# EAGLE board BikeBikeAja|V2 (EAGLE 9.6.2)
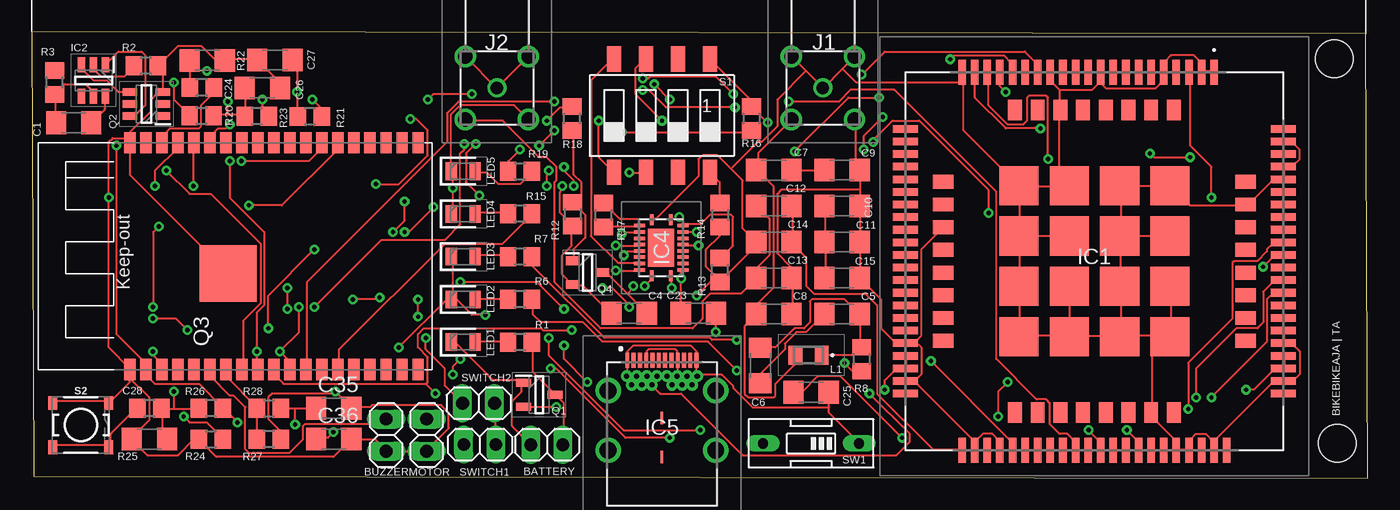
[diagram p4: board, top side]
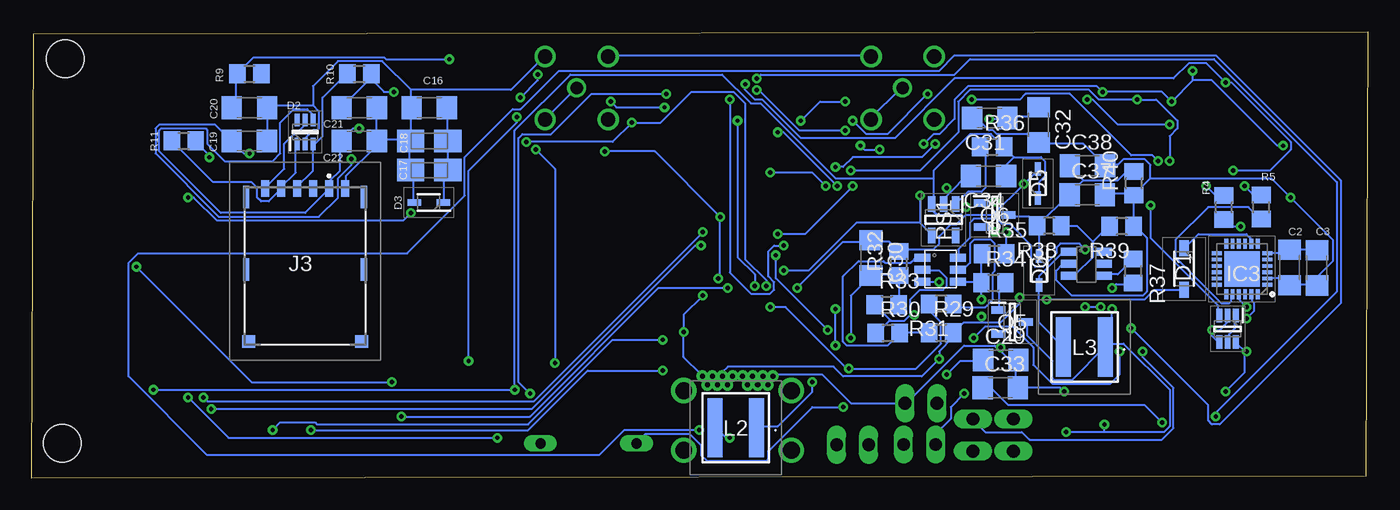
[diagram p5: board, bottom side, seen from below]

Size 106.04 x 35.45 mm. Coordinates in mm from the lower left corner, seen from the top.
Outline: 105.85,35.27 0,35.45 0.19,0.18 106.04,0 105.85,35.27
Copper layers (1*16): Top 0.035mm / dielectric 1.5mm / Bottom 0.035mm
Design rules "default": minimum track width 6mil, minimum drill 0.35mm, track to track 6mil, track to pad 6mil, pad to pad 6mil, via to via 6mil, smd to smd 6mil, copper to edge 40mil, drill to drill 6mil, minimum pad ring 10mil, minimum via ring 8mil, stop-mask expansion 4mil, vias tented up to drill 0mil, thermal gap 10mil
Holes 3 mm at 103.59,2.78 103.38,33.28

## Footprints (pad centres in the part's own frame; a part is rotated, then mirrored left to right if it is on the bottom)
1X02 = drill 1.016 long: 1 -1.27,0; 2 1.27,0
C1206 = smd 1.6 x 1.8: 1 -1.4,0; 2 1.4,0
A/3216-18W = smd 2.15 x 1.8: + 1.475,0; - -1.475,0
SOD3716X135N = smd 1.25 x 0.75: 1 -1.65,0; 2 1.65,0
SOT65P210X110-6N = smd 1 x 0.4: 1 -0.95,0.65; 2 -0.95,0; 3 -0.95,-0.65; 4 0.95,-0.65; 5 0.95,0; 6 0.95,0.65
SOD2513X114N = smd 1.075 x 0.5: 1 -1.15,0; 2 1.15,0
SIM7600GH = smd 0.6 x 2: 1 9.5,15; 2 8.5,15; 3 7.5,15; 4 6.5,15; 5 5.5,15; 6 4.5,15; 7 3.5,15; 8 2.5,15; 9 1.5,15; 10 0.5,15; 11 -0.5,15; 12 -1.5,15; 13 -2.5,15; 14 -3.5,15; 15 -4.5,15; 16 -5.5,15; 17 -6.5,15; 18 -7.5,15; 19 -8.5,15; 20 -9.5,15; 41 -9.5,-15; 42 -8.5,-15; 43 -7.5,-15; 44 -6.5,-15; 45 -5.5,-15; 46 -4.5,-15; 47 -3.5,-15; 48 -2.5,-15; 49 -1.5,-15; 50 -0.5,-15; 51 0.5,-15; 52 1.5,-15; 53 2.5,-15; 54 3.5,-15; 55 4.5,-15; 56 5.5,-15; 57 6.5,-15; 58 7.5,-15; 59 8.5,-15; 60 9.5,-15; 81 -10.5,15; 82 -10.5,-15; 85 10.5,-15 | smd 2 x 0.6: 21 -15,9.5; 22 -15,8.5; 23 -15,7.5; 24 -15,6.5; 25 -15,5.5; 26 -15,4.5; 27 -15,3.5; 28 -15,2.5; 29 -15,1.5; 30 -15,0.5; 31 -15,-0.5; 32 -15,-1.5; 33 -15,-2.5; 34 -15,-3.5; 35 -15,-4.5; 36 -15,-5.5; 37 -15,-6.5; 38 -15,-7.5; 39 -15,-8.5; 40 -15,-9.5; 61 15,-9.5; 62 15,-8.5; 63 15,-7.5; 64 15,-6.5; 65 15,-5.5; 66 15,-4.5; 67 15,-3.5; 68 15,-2.5; 69 15,-1.5; 70 15,-0.5; 71 15,0.5; 72 15,1.5; 73 15,2.5; 74 15,3.5; 75 15,4.5; 76 15,5.5; 77 15,6.5; 78 15,7.5; 79 15,8.5; 80 15,9.5; 83 -15,-10.5; 84 -15,10.5; 86 15,10.5; 87 15,-10.5 | smd 1.1 x 1.6: 88 6.3,12; 89 4.5,12; 90 2.7,12; 91 0.9,12; 92 -0.9,12; 93 -2.7,12; 94 -4.5,12; 95 -6.3,12; 104 -6.3,-12; 105 -4.5,-12; 106 -2.7,-12; 107 -0.9,-12; 108 0.9,-12; 109 2.7,-12; 110 4.5,-12; 111 6.3,-12 | smd 1.6 x 1.1: 96 -12,6.3; 97 -12,4.5; 98 -12,2.7; 99 -12,0.9; 100 -12,-0.9; 101 -12,-2.7; 102 -12,-4.5; 103 -12,-6.3; 112 12,-6.3; 113 12,-4.5; 114 12,-2.7; 115 12,-0.9; 116 12,0.9; 117 12,2.7; 118 12,4.5; 119 12,6.3 | smd 3.1 x 3.1: 120 6,6; 121 6,2; 122 6,-2; 123 6,-6; 124 2,6; 125 2,2; 126 2,-2; 127 2,-6; 128 -2,6; 129 -2,2; 130 -2,-2; 131 -2,-6; 132 -6,6; 133 -6,2; 134 -6,-2; 135 -6,-6
SOT95P280X145-6N = smd 1.2 x 0.6: 1 -1.25,0.95; 2 -1.25,0; 3 -1.25,-0.95; 4 1.25,-0.95; 5 1.25,0; 6 1.25,0.95
QFN50P400X400X80-25N = smd 0.8 x 0.3: 1 -2,1.25; 2 -2,0.75; 3 -2,0.25; 4 -2,-0.25; 5 -2,-0.75; 6 -2,-1.25; 13 2,-1.25; 14 2,-0.75; 15 2,-0.25; 16 2,0.25; 17 2,0.75; 18 2,1.25 | smd 0.3 x 0.8: 7 -1.25,-2; 8 -0.75,-2; 9 -0.25,-2; 10 0.25,-2; 11 0.75,-2; 12 1.25,-2; 19 1.25,2; 20 0.75,2; 21 0.25,2; 22 -0.25,2; 23 -0.75,2; 24 -1.25,2 | smd 2.8 x 2.8: 25 0,0
SN74LVC541ARGYR = smd 0.85 x 0.28: 1 -2.225,-0.75; 10 2.225,-0.75; 11 2.225,0.75; 20 -2.225,0.75 | smd 0.28 x 0.85: 2 -1.75,-1.725; 3 -1.25,-1.725; 4 -0.75,-1.725; 5 -0.25,-1.725; 6 0.25,-1.725; 7 0.75,-1.725; 8 1.25,-1.725; 9 1.75,-1.725; 12 1.75,1.725; 13 1.25,1.725; 14 0.75,1.725; 15 0.25,1.725; 16 -0.25,1.725; 17 -0.75,1.725; 18 -1.25,1.725; 19 -1.75,1.725 | smd 3.05 x 2.05: 21 0,0
632723100011 = smd 0.3 x 1.2: A1 -2.75,5.28; A2 -2.25,5.28; A3 -1.75,5.28; A4 -1.25,5.28; A5 -0.75,5.28; A6 -0.25,5.28; A7 0.25,5.28; A8 0.75,5.28; A9 1.25,5.28; A10 1.75,5.28; A11 2.25,5.28; A12 2.75,5.28 | drill 0.4 pad 0.7: B1 2.8,4.03; B2 2.4,3.33; B3 1.6,3.33; B4 1.2,4.03; B5 0.8,3.33; B6 0.4,4.03; B7 -0.4,4.03; B8 -0.8,3.33; B9 -1.2,4.03; B10 -1.6,3.33; B11 -2.4,3.33; B12 -2.8,4.03; G1 -2,4.03; G2 2,4.03 | drill 1.34 pad 2.01: MH1 -4.27,2.88; MH2 4.27,2.88; MH3 -4.27,-1.85; MH4 4.27,-1.85 | smd 0.2 x 1: MP1 0,0.7; MP2 0,-2.4
SMARACONNECTOR = drill 1.131 pad 1.697: 1 -6.376,2.5; 2 -1.376,2.5; 3 -6.376,-2.5; 4 -1.376,-2.5 | drill 1 pad 1.5: 5 -3.876,0
693043020611 = smd 0.65 x 1.3: C1 1.91,5.77; C2 -0.63,5.77; C3 -1.9,5.77; C5 3.18,5.77; C6 0.64,5.77; C7 -3.17,5.77 | smd 0.48 x 1.8: P1 -4.67,5.1; P2 -4.67,-0.65; P5 4.66,-0.65; P6 4.66,5.1 | smd 1.03 x 1: P3 -4.465,-6.37; P4 4.465,-6.37
B82498F = smd 1.1 x 1.5: 1 -1.05,0; 2 1.05,0
XFL5015152MEC = smd 1.18 x 4.7: 1 -1.655,0; 2 1.655,0
LEDC2012X85N = smd 0.9 x 1.4: 1 -0.95,0; 2 0.95,0
SOT95P280X145-5N = smd 1.2 x 0.6: 1 -1.25,0.95; 2 -1.25,0; 3 -1.25,-0.95; 4 1.25,-0.95; 5 1.25,0.95
SOT95P280X125-3N = smd 1.2 x 0.6: 1 -1.25,0.95; 2 -1.25,-0.95; 3 1.25,0
SOT95P285X140-6N = smd 1.15 x 0.6: 1 -1.3,0.95; 2 -1.3,0; 3 -1.3,-0.95; 4 1.3,-0.95; 5 1.3,0; 6 1.3,0.95
SOT65P230X110-6N = smd 1.05 x 0.45: 1 -1.05,0.65; 2 -1.05,0; 3 -1.05,-0.65; 4 1.05,-0.65; 5 1.05,0; 6 1.05,0.65
SOT95P240X120-3N = smd 1 x 0.7: 1 -1.2,0.95; 2 -1.2,-0.95; 3 1.2,0
SOT95P240X115-3N = smd 1.1 x 0.6: 1 -1.1,0.95; 2 -1.1,-0.95; 3 1.1,0
R0805 = smd 1.3 x 1.5: 1 -0.95,0; 2 0.95,0
SMS-004 = smd 1.092 x 2.007: 1 -3.81,-4.496; 2 -1.27,-4.496; 3 1.27,-4.496; 4 3.81,-4.496; 5 3.81,4.496; 6 1.27,4.496; 7 -1.27,4.496; 8 -3.81,4.496
TACTILE_SWITCH_SMD_4.5MM = smd 0.7 x 1.1: 1 2.225,1.75; 2 2.225,-1.75; 3 -2.225,-1.75; 4 -2.225,1.75
EDG-01 = drill 0.813 long: 1 0,-3.81; 2 0,3.81
JW5222 = smd 1.27 x 0.635: EN -1.27,0; FB 1.53,0; GND -1.27,-0.95; POK 1.53,-0.95; SW -1.27,-1.9; VIN 1.53,-1.9
ESP32-WROVER = smd 1.7 x 0.9: CLK 18,1.27; CMD 0,1.27; EN 0,21.59; GND 0,24.13; GND3 18,24.13; GND_2 0,6.35; IO0 18,7.62; IO2 18,6.35; IO4 18,8.89; IO5 18,12.7; IO12 0,7.62; IO13 0,5.08; IO14 0,8.89; IO15 18,5.08; IO18 18,13.97; IO19 18,15.24; IO21 18,17.78; IO22 18,21.59; IO23 18,22.86; IO25 0,12.7; IO26 0,11.43; IO27 0,10.16; IO32 0,15.24; IO33 0,13.97; IO34 0,17.78; IO35 0,16.51; NC0 18,16.51; NC1 18,10.16; NC2 18,11.43; RXD0 18,19.05; SD0 18,2.54; SD1 18,3.81; SD2 0,3.81; SD3 0,2.54; SENSOR_VN 0,19.05; SENSOR_VP 0,20.32; TXD0 18,20.32; VDD33 0,22.86 | smd 4.5 x 4.5: GND2 7.62,16.34
TCS9208 = smd 1.27 x 0.635: EN 4.07,-1.9; FB 1.27,-1.9; GND 1.27,-0.95; NC 4.07,0; SW 1.27,0; VIN 4.07,-0.95

## Placement (x,y rotation side)
BATTERY  [1X02]  40.89,2.68 0 top
BUZZER  [1X02]  28.13,3.44 270 top
C1  100nF  [C1206]  3.35,28.22 180 top
C2  10uF  [C1206]  6.23,16.73 270 bottom
C3  100nF  [C1206]  4.05,16.71 270 bottom
C4  0.1uF  [C1206]  47.42,13.1 0 top
C5  33pF  [C1206]  64.3,13.05 0 top
C6  100nF  [C1206]  57.83,8.96 90 top
C7  33pF  [C1206]  58.9,24.46 0 top
C8  NC  [C1206]  58.9,13.05 180 top
C9  NC  [C1206]  64.3,24.47 180 top
C10  10uF  [C1206]  64.3,21.61 0 top
C11  10uF  [C1206]  64.3,18.76 0 top
C12  0R  [C1206]  58.9,21.61 0 top
C13  NC  [C1206]  58.9,15.9 180 top
C14  NC  [C1206]  58.9,18.75 0 top
C15  1uF  [C1206]  64.3,15.9 0 top
C16  10uF  [C1206]  74.48,29.4 180 bottom
C17  100uF  [A/3216-18W]  74.48,24.46 0 bottom
C18  100uF  [A/3216-18W]  74.48,26.77 0 bottom
C19  22pF  [C1206]  88.76,26.77 0 bottom
C20  22pF  [C1206]  88.75,29.4 0 bottom
C21  22pF  [C1206]  80.03,29.4 0 bottom
C22  0.1uF  [C1206]  80.04,26.77 0 bottom
C23  100nF  [C1206]  52.91,13.1 180 top
C24  100nF  [C1206]  13.95,33.16 180 top
C25  33pF  [C1206]  61.85,6.84 180 top
C26  100nF  [C1206]  18.32,30.98 180 top
C27  10uF  [C1206]  19.31,33.19 0 top
C28  1uF  [C1206]  9.36,3.12 0 top
C29  22uF  [C1206]  29.13,9.4 0 bottom
C30  47pF  [C1206]  39.43,17.5 270 bottom
C31  22uF  [C1206]  30.01,28.59 180 bottom
C32  22uF  [C1206]  26.14,28.05 270 bottom
C33  100nF  [C1206]  29.17,7.2 0 bottom
C34  100nF  [C1206]  30.11,23.98 180 bottom
C35  1uF  [C1206]  23.98,5.57 0 top
C36  10uF  [C1206]  23.98,3.12 0 top
C37  22uF  [C1206]  22.27,22.5 0 bottom
C38  0.1uF  [C1206]  22.26,24.8 0 bottom
D1  1N4148_SOD-123_  [SOD3716X135N]  14.6,16.62 270 bottom
D2  SMF05C  [SOT65P210X110-6N]  84.33,27.48 90 bottom
D3  CDSOD323-T05L  [SOD2513X114N]  74.52,21.88 180 bottom
D5  CDSOD323-T05L  [SOD2513X114N]  26.19,23.39 90 bottom
D6  SS34  [SOD2513X114N]  26.1,16.5 270 bottom
IC1  SIM7600G-H  [SIM7600GH]  84.33,17.23 0 top
IC2  DW01B  [SOT95P280X145-6N]  4.93,31.57 270 top
IC3  CP2104-F03-GM  [QFN50P400X400X80-25N]  10,16.61 180 bottom
IC4  TXB0108RGYR  [SN74LVC541ARGYR]  49.96,18.3 90 top
IC5  632723100011  [632723100011]  50.02,4.09 0 top
J1  SMA-RA-CONNECTOR  [SMARACONNECTOR]  62.79,34.85 90 top
J2  SMA-RA-CONNECTOR  [SMARACONNECTOR]  36.93,34.85 90 top
J3  693043020611  [693043020611]  84.33,17.23 0 bottom
L1  B82498F3560G001  [B82498F]  61.65,9.78 180 top
L2  XFL5015-152MEC  [XFL5015152MEC]  50.17,4.03 180 bottom
L3  4.7uH  [XFL5015152MEC]  22.5,10.43 180 bottom
LED1  APT2012SURCK  [LEDC2012X85N]  34.25,10.82 0 top
LED2  APT2012SURCK  [LEDC2012X85N]  34.25,14.21 0 top
LED3  APT2012SURCK  [LEDC2012X85N]  34.25,17.59 0 top
LED4  APT2012SURCK  [LEDC2012X85N]  34.25,20.98 0 top
LED5  APT2012SURCK  [LEDC2012X85N]  34.25,24.37 0 top
MOTOR  [1X02]  31.35,3.44 270 top
PS1  MIC5231-3.3YM5-TR  [SOT95P280X145-5N]  33.68,20.52 270 bottom
Q1  AO3400  [SOT95P280X125-3N]  40.28,6.64 0 top
Q2  UMW8205A  [SOT95P285X140-6N]  9.12,29.7 180 top
Q3  UMH3N  [SOT65P230X110-6N]  11.14,11.87 270 bottom
Q4  MMBT3904  [SOT95P240X120-3N]  44.11,16.33 0 top
Q5  NCE3401  [SOT95P240X115-3N]  28.23,12.42 0 bottom
Q6  NCE3401  [SOT95P240X115-3N]  29.62,20.89 0 bottom
R1  10K  [R0805]  38.76,10.82 180 top
R2  1K  [R0805]  9.07,32.73 180 top
R3  100R  [R0805]  1.84,31.42 90 top
R4  470R  [R0805]  11.43,21.5 90 bottom
R5  470R  [R0805]  8.47,21.52 90 bottom
R6  390R  [R0805]  38.76,14.21 180 top
R7  390R  [R0805]  38.76,17.59 180 top
R8  0R  [R0805]  65.87,9.46 90 top
R9  22R  [R0805]  88.75,32.09 0 bottom
R10  22R  [R0805]  80.03,32.09 0 bottom
R11  22R  [R0805]  93.96,26.78 0 bottom
R12  47K  [R0805]  45.4,20.9 90 top
R13  47  [R0805]  54.64,16.53 90 top
R14  10K  [R0805]  54.64,20.9 270 top
R15  10K  [R0805]  38.76,20.98 180 top
R16  NC  [R0805]  57.12,28.54 270 top
R17  47K  [R0805]  42.94,20.96 270 top
R18  47K  [R0805]  42.9,28.54 90 top
R19  390R  [R0805]  38.76,24.37 0 top
R20  NC  [R0805]  13.5,28.77 0 top
R21  NC  [R0805]  22.09,28.71 180 top
R22  NC  [R0805]  13.51,31.01 180 top
R23  NC  [R0805]  17.88,28.72 180 top
R24  10K  [R0805]  14.23,5.57 180 top
R25  22R  [R0805]  9.36,5.57 180 top
R26  10K  [R0805]  14.23,3.12 0 top
R27  10K  [R0805]  18.84,3.12 180 top
R28  10K  [R0805]  18.84,5.57 0 top
R29  100K  [R0805]  33.87,11.57 0 bottom
R30  100K  [R0805]  38.1,11.54 0 bottom
R31  10K  [R0805]  33.86,13.84 180 bottom
R32  120K  [R0805]  37.22,17.04 90 bottom
R33  20K  [R0805]  38.18,13.79 0 bottom
R34  20K  [R0805]  29.72,15.53 0 bottom
R35  20K  [R0805]  29.65,17.82 0 bottom
R36  10K  [R0805]  29.82,26.32 0 bottom
R37  10K  [R0805]  18.64,16.45 270 bottom
R38  120K  [R0805]  25.29,20.03 180 bottom
R39  20K  [R0805]  19.54,20 180 bottom
R40  100K  [R0805]  18.57,23.41 90 bottom
S1  SWS004  [SMS-004]  50.02,28.78 180 top
S2  MOMENTARY-SWITCH-SPST-SMD-4.5MM  [TACTILE_SWITCH_SMD_4.5MM]  3.91,4.24 0 top
SW1  [EDG-01]  61.85,2.78 90 top
SWITCH1  [1X02]  35.57,2.69 0 top
SWITCH2  [1X02]  35.47,5.97 0 top
U$1  JW5222  [JW5222]  34.07,17.51 0 bottom
U$3  ESP32-WROVER  [ESP32-WROVER]  31.94,8.63 90 top
U$4  TCS9208  [TCS9208]  25.01,17.98 0 bottom

## Tracks (layer width: path | path; a pad name or v marks a point on that pad's centre or on a via)
CLK_EN
  Bottom 0.152: D2.1 85.08,26.39 85.08,24.26 86.3,23.04 J3.C3 86.3,22.89 87.21,21.97 87.82,21.97 88.12,22.28 88.12,23.04 88.58,23.5 91.63,23.5 94.83,26.7 R11.1
DATA_EN
  Bottom 0.152: D2.5 84.47,28.37 84.47,27.92 85.08,27.31 85.23,27.31 85.99,26.54 85.99,24.56 87.52,23.04 J3.C7
DTR  (via drill 0.35)
  Top 0.152: v9.64,12.68 11.47,12.68 v12.38,11.76
  Bottom 0.152: v9.64,12.68 9.03,13.29 9.03,13.9 9.18,14.05 9.18,14.51 IC3.23 | Q3.4 11.92,10.85 12.38,11.3 v12.38,11.76 11.77,11.76 11.16,12.37 11.16,12.83 Q3.2
DVDD4V2  (via drill 0.35)
  Top 0.152: IC1.38 69.38,9.63 69.38,8.87 IC1.39 69.23,8.71 68.62,8.71 67.7,7.8 v67.7,7.04 | IC1.63 99.4,9.63 99.4,8.87 IC1.62 99.25,8.71 98.64,8.71 96.96,7.04 v96.35,7.04 | v29.6,19.54 29.91,19.54 v31.89,21.52
  Bottom 0.152: 34.48,23.8 34.48,24.41 31.58,27.31 29.91,27.31 28.99,26.39 R36.2 28.84,26.24 28.08,25.48 | 34.48,23.8 34.48,21.82 PS1.3 34.48,21.67 34.48,21.21 34.17,20.91 32.35,20.91 32.19,21.06 32.19,21.21 v31.89,21.52 | v96.35,7.04 v67.7,7.04 67.7,27.61 63.28,32.03 51.24,32.03 48.96,29.75 48.2,29.75 42.25,23.8 34.48,23.8 | v29.6,19.54 29.91,19.84 30.67,19.84 Q6.2 | 28.08,25.48 25.95,25.48 25.64,25.17 25.64,23.95 26.1,23.5 26.1,22.28 D5.1 | 28.08,25.48 28.69,24.87 28.69,24.11 C34.1
G2
  Top 0.152: Q2.4 6.9,30.66 5.98,31.57 4.91,31.57 4,32.49 4,32.79 IC2.3
GPIO26  (via drill 0.35)
  Top 0.152: v48.65,15.27 49.11,15.72 49.11,16.03 IC4.20 | v50.02,28.37 47.89,30.51 47.89,32.49 48.65,33.25 S1.3
  Bottom 0.152: v48.65,15.27 48.65,16.18 50.02,17.55 v50.02,28.37
GPIO27
  Top 0.152: IC4.18 48.2,17.1 46.52,17.1 44.39,19.23 44.39,31.57 46.06,33.25 S1.4
IO0  (via drill 0.35)
  Top 0.152: v17.26,21.67 19.85,21.67 24.27,26.09 24.27,26.54 U$3.IO0
  Bottom 0.152: v17.26,21.67 17.26,19.08 11.92,13.74 11.92,12.98 Q3.3
IO4  (via drill 0.35)
  Top 0.152: v40.88,28.37 41.95,29.44 42.86,29.44 R18.2 | v34.94,30.51 31.89,30.51 v31.43,30.05 | v16.65,25.17 21.98,25.17 23.05,26.24 U$3.IO4
  Bottom 0.152: v40.88,28.37 39.81,27.31 38.14,27.31 v34.94,30.51 | v31.43,30.05 27.62,30.05 27.17,30.51 23.66,30.51 18.78,25.63 17.11,25.63 v16.65,25.17
IO12
  Top 0.152: R15.1 39.66,20.91 37.38,18.62 32.8,18.62 24.42,10.24 24.42,8.71 U$3.IO12
IO21  (via drill 0.35)
  Top 0.152: v22.29,30.05 22.9,29.44 22.9,28.83 R21.1 | v15.73,28.07 15.43,27.76 14.82,27.76 14.21,27.16 14.21,26.7 U$3.IO21
  Bottom 0.152: v22.29,30.05 21.83,30.05 19.85,28.07 v15.73,28.07
IO22
  Top 0.152: R22.1 14.36,30.96 14.36,30.51 13.45,29.59 13.45,27.92 13.3,27.76 11.01,27.76 10.4,27.16 10.4,26.7 U$3.IO22
IO25  (via drill 0.35)
  Top 0.152: v46.98,17.71 47.28,18.01 48.2,18.01 IC4.16 | v42.86,11.76 40.58,11.76 40.42,11.91 31.13,11.91 30.67,11.46 30.67,10.39 31.43,9.63 31.43,7.65 31.28,7.5 | 31.28,7.5 20,7.5 19.24,8.26 U$3.IO25 | 31.28,7.5 v32.04,6.73
  Bottom 0.152: v46.98,17.71 46.98,15.88 v42.86,11.76 | v32.04,6.73 33.11,5.67 33.11,4.75 34.17,3.69 34.17,2.77 SWITCH1.1
IO26  (via drill 0.35)
  Top 0.152: v31.28,11.15 31.28,10.24 32.8,8.71 32.8,7.34 34.17,5.97 SWITCH2.1 | U$3.IO26 20.46,8.71 20.46,9.32 v19.7,10.09 21.22,11.61 v21.22,13.59 | v47.43,24.26 48.65,24.26 S1.6 | v43.01,23.19 43.01,23.65 42.25,24.41 v42.25,24.72 | v34.33,26.54 34.33,26.09 34.02,25.78 34.02,20.14 32.8,18.93 27.77,18.93 v22.44,13.59
  Bottom 0.152: v19.7,10.09 19.7,8.26 20.46,7.5 25.03,7.5 26.55,9.02 26.55,10.39 28.23,12.07 30.37,12.07 v31.28,11.15 | v47.43,24.26 44.08,24.26 v43.01,23.19 | v42.25,24.72 41.64,24.72 40.88,25.48 35.39,25.48 v34.33,26.54 | v21.22,13.59 v22.44,13.59
IO27  (via drill 0.35)
  Top 0.152: v41.49,29.9 33.87,29.9 32.96,28.98 32.96,26.7 21.83,15.57 21.83,8.71 U$3.IO27 | v45,28.37 45,25.48 46.06,24.41 S1.5
  Bottom 0.152: v41.49,29.9 43.47,29.9 v45,28.37
IO32  (via drill 0.35)
  Top 0.152: v46.37,18.47 48.2,18.47 IC4.15 | v49.41,31.27 v50.63,30.05 | v11.31,31.42 11.31,30.05 12.53,28.83 R20.1 | v10.71,24.41 12.53,22.58 14.21,22.58 18.17,18.62 18.17,13.9 16.8,12.52 16.8,8.71 U$3.IO32
  Bottom 0.152: v46.37,18.47 47.13,18.47 47.59,18.01 47.59,16.03 47.13,15.57 47.13,14.96 47.43,14.66 48.96,14.66 50.63,16.33 v50.63,30.05 | v49.41,31.27 49.41,30.81 48.65,30.05 48.04,30.05 45,27 37.53,27 32.8,31.73 15.43,31.73 14.21,32.95 12.84,32.95 v11.31,31.42 10.86,31.42 6.13,26.7 6.13,26.09 7.81,24.41 v10.71,24.41
IO33  (via drill 0.35)
  Top 0.152: U$3.IO33 17.87,8.71 v17.87,10.09 17.87,13.13 18.48,13.74 18.48,19.54 15.73,22.28 v15.73,25.17 | v46.82,19.38 46.98,19.54 48.2,19.54 IC4.13 | v40.88,23.19 40.88,24.26 v41.03,24.41 | v18.33,30.05 18.33,29.29 18.78,28.83 R23.1
  Bottom 0.152: v17.87,10.09 17.87,9.63 15.43,7.19 15.43,3.99 16.34,3.08 26.86,3.08 27.47,3.69 30.37,3.69 31.28,4.6 MOTOR.1 | v46.82,19.38 44.69,19.38 v40.88,23.19 | v41.03,24.41 35.55,24.41 32.5,27.46 32.5,29.9 31.58,30.81 22.14,30.81 21.37,30.05 v18.33,30.05 16.8,30.05 15.12,28.37 15.12,27.76 15.73,27.16 v15.73,25.17
IO34
  Top 0.152: U$3.IO34 14.21,8.56 14.21,8.11 15.73,6.58 16.04,6.58 16.95,5.67 16.95,2.31 17.26,2.01 20.46,2.01 21.53,3.08 21.53,4.14 21.68,4.29 27.77,4.29 28.08,4.6 BUZZER.1
IO35
  Top 0.152: R27.2 17.87,3.23 17.87,5.51 R28.1 17.87,5.67 15.43,8.11 U$3.IO35
MAIN_ANT
  Top 0.152: C12.2 60.39,21.52 60.39,18.77 C14.2 60.39,18.62 61.45,17.55 61.45,15.27 62.06,14.66 66.18,14.66 67.09,13.74 67.09,6.73 71.51,2.31 73.8,2.31 IC1.82
N$1
  Top 0.152: LED1.2 35.24,10.85 37.68,10.85 R1.2
N$2
  Top 0.152: BATTERY.1 39.51,2.77 38.14,4.14 38.14,6.12 38.9,6.89 38.9,7.5 Q1.1 38.9,7.65 38.75,7.8 36.61,7.8 33.72,10.7 33.41,10.7 LED1.1
N$3
  Top 0.152: BATTERY.2 42.25,2.77 42.25,5.97 41.64,6.58 Q1.3 41.49,6.73 39.81,8.41 39.81,10.7 R1.1
N$4  (via drill 0.35)
  Top 0.152: v41.64,5.67 39.05,5.67 Q1.2
  Bottom 0.152: v41.64,5.67 44.08,5.67 47.59,2.16 47.59,1.55 47.74,1.4 52.46,1.4 52.92,1.86 52.92,2.62 53.84,3.53 57.34,3.53 57.95,2.92 SW1.2
N$5
  Top 0.152: Q2.6 7.96,28.83 8.27,28.83 9.03,29.59 9.03,33.56 8.72,33.86 6.9,33.86 5.98,32.95 IC2.1
N$6
  Top 0.152: IC2.6 5.83,30.2 5.83,29.29 4.76,28.22 C1.1
N$7
  Top 0.152: IC2.5 4.91,30.36 4.91,30.66 4.31,31.27 2.63,31.27 1.87,30.51 R3.1 1.87,30.36 1.87,28.22 C1.2
N$9
  Top 0.152: IC2.2 5.07,32.79 5.07,32.34 5.52,31.88 7.35,31.88 8.12,32.64 R2.2
N$10
  Bottom 0.152: IC3.7 8.88,18.62 9.18,18.62 IC3.8 9.33,18.62 9.33,19.08 9.64,19.38 13.45,19.38 14.52,18.32 D1.1
N$11  (via drill 0.35)
  Top 0.152: v9.64,13.59 9.64,19.54 v10.1,19.99
  Bottom 0.152: v9.64,13.59 10.25,14.2 10.25,14.51 IC3.21 | v10.1,19.99 10.86,19.99 11.31,20.45 R4.1
N$12
  Bottom 0.152: IC3.20 10.86,14.51 10.86,14.05 11.01,13.9 11.62,13.9 15.28,17.55 15.28,18.93 12.69,21.52 9.49,21.52 8.57,20.6 R5.1
N$13
  Top 0.152: S2.3 1.71,2.62 6.13,2.62 S2.2 6.29,2.62 6.29,3.53 8.27,5.51 R25.2
N$14  (via drill 0.35)
  Top 0.152: v12.08,4.9 12.53,4.45 13.91,4.45 15.12,3.23 R26.2 | v48.5,31.73 48.96,31.73 49.11,31.88 54.29,31.88 v55.66,30.51 | v66.48,6.73 69.68,3.53 69.68,2.92 68.62,1.86 56.43,1.86 51.55,6.73 49.87,6.73 49.26,7.34 IC5.B8
  Bottom 0.152: v12.08,4.9 12.08,5.21 2.48,14.81 2.48,23.5 12.23,33.25 31.58,33.25 32.8,32.03 48.2,32.03 v48.5,31.73 | v55.66,30.51 61.61,30.51 64.81,27.31 67.09,27.31 67.4,27 67.4,7.65 v66.48,6.73
N$15
  Bottom 0.152: U$1.EN 35.39,17.4 36,17.4 36.31,17.1 38.29,17.1 38.44,17.25 40.42,17.25 41.64,16.03 41.64,10.85 41.34,10.54 38.14,10.54 37.22,11.46 R30.2 37.07,11.61 34.94,11.61 R29.1
N$16  (via drill 0.35)
  Top 0.152: v34.02,15.57 40.12,15.57 v42.25,13.44 | v42.25,10.54 42.25,9.48 v44.08,7.65
  Bottom 0.152: v34.02,15.57 35.24,15.57 U$1.SW | v42.25,10.54 v42.25,13.44 | v44.08,7.65 44.08,6.89 46.82,4.14 48.5,4.14 L2.1
N$17
  Bottom 0.152: U$1.POK 32.5,16.64 32.04,16.64 31.58,17.1 31.58,18.62 31.28,18.93 29.91,18.93 29.6,18.62 29.6,16.49 29.76,16.33 29.76,14.2 30.37,13.59 32.65,13.59 32.8,13.74 R31.1
N$18
  Bottom 0.152: Q5.1 29.3,13.44 29.3,14.96 28.84,15.42 R34.2
N$19  (via drill 0.35)
  Top 0.152: v22.44,18.16 18.78,14.51 v18.78,11.91 | v53.07,3.84 46.98,3.84 41.03,9.78 v41.03,11.15
  Bottom 0.152: v22.44,18.16 22.9,18.62 24.42,18.62 24.73,18.32 24.73,17.86 25.79,16.79 26.4,16.79 26.71,17.1 26.71,18.47 28.38,20.14 28.99,20.14 29.45,20.6 31.28,20.6 31.58,20.3 31.58,19.08 32.5,18.16 32.5,17.55 U$1.FB | v18.78,11.91 12.69,5.82 12.69,4.6 12.38,4.29 11.77,4.29 2.17,13.9 2.17,23.65 12.08,33.56 32.8,33.56 34.02,32.34 64.2,32.34 67.25,29.29 67.86,29.29 71.67,25.48 71.67,22.43 76.24,17.86 97.57,17.86 98.34,17.1 98.34,8.11 92.09,1.86 61,1.86 59.02,3.84 v53.07,3.84 | v41.03,11.15 41.03,14.51 39.51,16.03 C30.2 39.36,16.18 37.22,16.18 R32.1 37.22,16.03 37.22,13.9 R33.2
N$20  (via drill 0.35)
  Top 0.152: v55.97,8.56 53.68,10.85 45.3,10.85 43.78,12.37 40.42,12.37 39.81,12.98 39.81,14.2 R6.1 | v83.86,3.84 84.77,2.92 84.77,2.31 IC1.51
  Bottom 0.152: v55.97,8.56 61.91,8.56 66.64,3.84 v83.86,3.84
N$21
  Top 0.152: LED2.2 35.24,14.2 37.68,14.2 R6.2
N$22
  Top 0.152: LED3.2 35.24,17.71 37.68,17.71 R7.2
N$23  (via drill 0.35)
  Top 0.152: v55.97,11 53.99,11 53.84,11.15 45.45,11.15 39.81,16.79 39.81,17.55 R7.1 | v86.91,3.84 87.82,2.92 87.82,2.31 IC1.54
  Bottom 0.152: v55.97,11 59.93,11 66.64,4.29 83.4,4.29 83.55,4.45 86.3,4.45 v86.91,3.84
N$24
  Top 0.152: C6.1 57.95,7.65 57.95,8.41 59.78,10.24 59.78,10.7 60.69,11.61 61.45,11.61 62.83,12.98 C5.1
N$26
  Top 0.152: L1.1 62.83,9.78 65.11,9.78 65.72,10.39 R8.2 65.72,10.54 65.72,12.98 C5.2 65.57,13.13 64.5,14.2 61.91,14.2 61.76,14.05 61.76,12.37 61.3,11.91 60.54,11.91 59.02,10.39 57.95,10.39 C6.2
N$28
  Top 0.152: L1.2 60.54,9.63 60.54,9.02 59.02,7.5 59.02,6.58 58.86,6.43 56.88,6.43 56.58,6.73 56.58,12.07 57.49,12.98 C8.2 57.64,13.13 57.64,13.9 58.86,15.12 58.86,23.19 57.64,24.41 C7.1 57.64,24.56 57.64,25.78 60.24,28.37 J1.1
N$29
  Top 0.152: C7.2 60.39,24.41 62.83,24.41 C9.2
N$30
  Top 0.152: C15.1 62.98,16.03 62.98,18.62 C11.1 62.98,18.77 62.98,21.52 C10.1
N$32
  Bottom 0.152: D3.1 73.34,21.97 73.34,24.11 73.04,24.41 C17.+ 73.04,24.56 73.04,26.7 C18.+ 73.04,26.85 73.04,29.29 C16.1
N$34
  Top 0.152: C12.1 57.64,21.52 58.56,20.6 58.56,17.71 57.64,16.79 57.64,16.03 C13.2 57.49,15.88 56.27,14.66 53.84,14.66 53.22,14.05 53.22,12.68 52.46,11.91 45.15,11.91 41.49,15.57 41.49,23.5 41.64,23.65 41.64,24.72 40.88,25.48 40.27,25.48 37.38,28.37 34.48,28.37 J2.1
N$35
  Top 0.152: IC4.12 48.2,19.99 45.45,19.99 R12.1
N$36
  Top 0.152: IC4.9 51.7,20.14 53.07,20.14 53.84,20.91 55.51,20.91 55.66,20.75 55.66,18.47 54.75,17.55 R13.2
N$37
  Top 0.152: R14.1 54.6,21.97 54.6,23.5 53.84,24.26 S1.8
N$38
  Top 0.152: LED4.2 35.24,21.06 37.68,21.06 R15.2
N$39  (via drill 0.35)
  Top 0.152: v69.08,3.23 64.2,8.11 62.37,8.11 61.15,6.89 60.54,6.89 C25.2 | v93.61,6.43 98.03,10.85 98.03,14.2 98.49,14.66 99.25,14.66 IC1.68
  Bottom 0.152: v69.08,3.23 90.41,3.23 v93.61,6.43
N$40
  Top 0.152: Q4.1 43.01,17.4 43.01,18.16 43.93,19.08 43.93,20.91 43.01,21.82 R17.1 43.01,21.97 43.62,22.58 43.62,23.5 43.01,24.11 43.01,27.46 R18.1
N$41  (via drill 0.35)
  Top 0.152: C4.1 45.91,13.13 43.78,15.27 43.01,15.27 Q4.2 42.86,15.42 42.1,16.18 42.1,17.71 42.86,18.47 42.86,19.99 R17.2 42.86,20.14 41.95,21.06 41.95,22.73 42.1,22.89 v42.1,23.19 | v46.82,27.46 57.03,27.46 R16.2
  Bottom 0.152: v46.82,27.46 46.37,27.46 v42.1,23.19
N$42
  Top 0.152: LED5.2 35.24,24.26 36.16,24.26 37.07,23.34 38.75,23.34 39.66,24.26 R19.2
N$43  (via drill 0.35)
  Top 0.152: v29.6,21.97 29.6,20.45 v28.69,19.54
  Bottom 0.152: v29.6,21.97 30.67,21.97 Q6.1 | v28.69,19.54 28.69,17.86 R35.2
N$44
  Bottom 0.152: PS1.1 32.65,21.82 31.74,22.73 30.67,22.73 30.37,23.04 30.37,25.94 30.67,26.24 R36.1
N$45
  Bottom 0.152: U$4.SW 23.81,17.86 24.27,17.86 26.1,16.03 26.1,15.42 D6.2 26.1,15.27 26.1,12.37 24.27,10.54 L3.2
N$46
  Bottom 0.152: U$4.EN 20.92,16.18 19.85,16.18 18.78,17.25 R37.1
N$48
  Bottom 0.152: 21.83,18.77 21.83,17.55 23.2,16.18 23.66,16.18 U$4.FB | 21.83,18.77 20.61,19.99 R39.2 | 21.83,18.77 23.05,19.99 24.27,19.99 R38.1
PE  (via drill 0.35)
  Top 0.152: LED2.1 33.41,14.35 33.41,17.55 LED3.1 | v36,12.98 34.94,12.98 33.72,14.2 33.41,14.2 LED2.1 | SWITCH1.2 36.77,2.77 36.77,5.82 SWITCH2.2 | v29.15,10.39 32.96,14.2 33.26,14.2 LED2.1 | 63.28,5.67 63.28,5.21 65.57,2.92 SW1.1 | 63.28,5.67 63.28,6.73 C25.1 | IC5.G1 47.89,8.11 47.28,8.11 IC5.B12 47.28,8.26 47.28,9.32 IC5.A1 47.28,9.48 47.28,10.09 47.74,10.54 52.31,10.54 52.77,10.09 52.77,9.48 IC5.A12 52.77,9.32 52.77,8.26 IC5.B1 | v54.29,11.61 54.29,12.98 C23.1 | IC5.G2 52.16,8.11 52.77,8.11 IC5.B1 | 63.28,5.67 57.19,5.67 55.66,7.19 55.66,7.34 54.75,8.26 52.92,8.26 IC5.B1 | C26.1 19.7,31.12 19.7,31.42 18.02,33.1 C27.1 17.87,33.25 15.43,33.25 C24.1 15.28,33.25 14.52,33.25 13.45,34.32 11.62,34.32 10.1,32.79 R2.1 10.1,32.64 10.4,32.34 10.4,30.66 Q2.3 10.4,30.51 9.94,30.51 9.49,30.05 9.49,29.14 7.81,27.46 7.81,27 | 7.81,27 U$3.GND3 | U$3.GND3 7.81,24.11 15.58,16.33 U$3.GND2 | S2.4 1.71,6.12 6.13,6.12 S2.1 6.29,6.12 7.81,7.65 7.81,7.95 | 7.81,7.95 U$3.GND | 7.81,7.95 9.33,6.43 9.33,4.6 7.96,3.23 C28.1 7.96,3.08 9.18,1.86 11.62,1.86 12.84,3.08 13.14,3.08 R26.1 13.3,3.08 14.67,1.7 23.96,1.7 25.34,3.08 C36.2 25.49,3.08 27.32,3.08 28.08,2.31 BUZZER.2 28.23,2.16 31.28,2.16 MOTOR.2 31.43,2.31 33.11,3.99 33.11,5.21 32.5,5.82 27.01,5.82 26.86,5.67 25.49,5.67 C35.2 25.34,5.67 24.27,6.73 24.12,6.73 | 7.81,8.56 U$3.GND | 24.12,6.73 19.09,6.73 18.78,6.43 18.78,4.75 19.7,3.84 19.7,3.23 R27.1 | 7.81,27 6.44,27 6.13,26.7 v6.13,22.28 6.13,10.39 7.81,8.71 U$3.GND | 7.81,26.7 U$3.GND3 | 24.12,6.73 v24.12,6.89 | IC1.80 99.4,26.7 100.01,26.7 100.62,26.09 100.62,25.33 100.16,24.87 99.4,24.87 IC1.78 99.4,24.72 99.4,23.8 IC1.77 99.25,23.65 98.49,23.65 96.66,21.82 96.35,21.82 IC1.118 96.2,21.67 91.94,21.67 90.41,23.19 IC1.120 90.26,23.19 86.45,23.19
  Top 0.152: IC1.121 86.45,19.23 | 86.45,23.19 86.45,19.23 | 86.45,23.19 IC1.124 | IC1.65 99.4,11.61 99.4,10.85 IC1.64 99.4,10.7 100.01,10.7 100.62,10.09 100.62,8.26 100.16,7.8 99.4,7.8 IC1.61 99.25,7.65 98.49,7.65 93.76,2.92 | 93.76,2.92 93.76,2.31 IC1.60 93.76,2.92 | 93.76,2.92 93.15,3.53 92.39,3.53 91.94,3.08 91.94,2.31 IC1.58 91.78,2.31 90.87,2.31 IC1.57 90.72,2.31 90.72,3.08 88.89,4.9 88.89,5.21 IC1.110 88.89,5.36 88.89,11.3 | IC1.1 93.76,32.34 92.85,32.34 IC1.2 92.7,32.34 92.7,33.1 92.24,33.56 90.41,33.56 89.95,33.1 89.95,32.34 IC1.5 89.8,32.18 89.8,31.57 89.19,30.96 85.23,30.96 84.77,31.42 | 81.57,30.81 81.57,29.29 IC1.93 81.57,29.14 81.57,23.19 | 81.57,30.81 80.96,31.42 80.96,32.18 IC1.14 | 84.77,31.42 84.77,32.18 IC1.10 84.77,31.42 | 84.77,31.42 84.16,30.81 81.57,30.81 | 86.45,11.3 86.45,15.12 IC1.126 86.45,15.27 86.45,19.23 | IC1.123 90.41,11.3 90.41,15.12 IC1.122 | 88.89,11.3 90.26,11.3 IC1.123 | 88.89,11.3 86.45,11.3 | 86.45,11.3 IC1.127 86.3,11.3 82.33,11.3 | 78.37,11.3 78.37,15.12 IC1.134 78.37,15.27 78.37,19.23 | 82.33,11.3 82.33,15.12 IC1.130 | 78.37,11.3 82.18,11.3 IC1.131 82.33,11.3 | 78.37,11.3 IC1.135 | IC1.129 78.37,19.23 | 73.95,31.42 73.95,27.61 78.22,23.34 IC1.132 78.37,23.19 | 73.95,31.42 73.95,32.18 IC1.81 73.95,31.42 | 78.37,23.19 81.57,23.19 | 81.57,23.19 82.18,23.19 IC1.128 81.57,23.19 | 78.37,23.19 78.37,19.23 | 78.37,19.23 IC1.133 | 88.89,11.3 IC1.123 | 86.45,19.23 IC1.125 | 74.87,2.92 74.87,2.31 IC1.41 74.87,2.92 | 74.87,2.92 75.48,3.53 76.24,3.53 76.69,3.08 76.69,2.31 IC1.43 | 70.14,10.85 70.6,11.3 70.6,18.16 72.27,19.84 IC1.98 | 70.14,10.85 69.38,10.85 IC1.37
  Top 0.152: 69.99,7.8 70.14,7.8 70.6,8.26 70.6,10.39 70.14,10.85 | 69.99,7.8 69.38,7.8 IC1.40 69.99,7.8 | 70.14,10.85 IC1.37 | 69.99,7.8 74.87,2.92 | J2.4 39.36,33.4 37.07,31.12 J2.5 36.92,30.96 34.48,33.4 J2.2 | LED4.1 33.41,21.06 v33.41,23.04 33.41,24.26 LED5.1 33.26,24.41 33.26,28.83 34.02,29.59 38.29,29.59 39.36,28.53 J2.3 | R12.2 45.45,21.82 46.67,20.6 49.11,20.6 IC4.11 49.26,20.6 49.57,20.6 52.92,23.95 52.92,25.33 53.22,25.63 54.44,25.63 55.51,24.56 | R13.1 54.75,15.72 57.64,18.62 C14.1 57.49,18.77 56.43,19.84 56.43,23.65 55.51,24.56 | 54.29,16.03 54.6,15.72 R13.1 | 54.29,16.03 53.53,16.79 53.53,18.16 54.6,19.23 54.6,19.84 R14.2 | 61.45,32.34 60.39,33.4 J1.2 | 61.45,32.34 62.67,31.12 J1.5 62.83,30.96 64.35,32.49 | 64.35,32.49 65.27,33.4 J1.4 | C8.1 60.39,13.13 60.39,15.88 C13.1 60.24,16.03 60.24,16.79 59.17,17.86 59.17,22.58 59.47,22.89 65.72,22.89 | 65.72,22.89 65.72,24.41 C9.1 65.57,24.56 65.42,24.72 65.42,28.37 J1.3 | 65.72,22.89 65.72,21.67 C10.2 65.72,21.52 65.72,18.77 C11.2 65.72,18.62 65.72,16.03 C15.2 65.72,15.88 67.4,14.2 67.4,11.91 68.47,10.85 69.23,10.85 IC1.37 | 55.51,24.56 57.64,26.7 57.95,26.7 59.17,27.92 59.17,30.05 61.45,32.34 | 73.95,31.42 65.42,31.42 64.35,32.49 | 54.29,16.03 v52.77,14.51 | 54.29,16.03 R13.1
  Bottom 0.152: 36.31,12.98 36.31,14.2 35.55,14.96 33.72,14.96 33.41,15.27 33.41,15.88 34.02,16.49 35.24,16.49 U$1.GND | 36.31,12.98 36.77,12.52 37.83,12.52 | 37.83,12.52 37.98,12.52 38.9,11.61 R30.1 | 37.83,12.52 39.05,13.74 R33.1 | 36.31,12.98 v36,12.98 | 27.93,9.48 28.54,9.48 29.3,10.24 | 27.93,9.48 27.77,9.48 C29.2 27.93,9.48 | 29.3,10.24 29.6,10.54 32.04,10.54 36.61,5.97 SWITCH2.2 36.77,5.97 41.03,5.97 43.32,8.26 47.13,8.26 IC5.B12 | 29.3,10.24 v29.15,10.39 | IC5.B1 52.92,8.26 54.29,9.63 v54.29,11.61 54.29,12.98 v52.77,14.51 | IC3.2 7.96,15.88 6.74,15.88 6.29,15.42 C2.2 6.13,15.42 4.15,15.42 C3.2 4,15.42 4,16.03 2.78,17.25 2.78,18.93 v6.13,22.28 7.66,23.8 17.26,23.8 | 17.26,23.8 18.48,22.58 R40.1 | 17.26,23.8 17.26,24.87 17.72,25.33 19.39,25.33 19.85,24.87 20.76,24.87 C38.2 20.92,24.87 22.59,26.54 26.1,26.54 C32.2 26.25,26.7 26.86,27.31 29.45,27.31 29.76,27.61 30.06,27.61 30.98,28.53 31.28,28.53 C31.2 | v24.12,6.89 24.42,7.19 27.62,7.19 C33.2 27.77,7.34 27.93,7.5 27.93,9.48 | 33.11,22.73 31.89,23.95 31.58,23.95 C34.2 | 33.11,22.73 33.57,22.28 33.57,21.82 PS1.2 | v33.41,23.04 33.11,22.73 | J2.5 37.07,30.96 39.51,28.53 J2.3 | J3.C5 81.11,23.04 81.11,23.95 78.68,26.39 78.68,26.7 C22.2 | C21.2 78.68,29.29 78.68,26.85 C22.2 | 83.7,29.59 83.25,29.14 83.25,27.76 83.4,27.61 83.7,27.61 84.31,27 84.31,26.54 D2.2 | 83.7,29.59 87.06,29.59 87.21,29.44 C20.2 87.36,29.29 87.36,26.85 C19.2 | D3.2 75.78,21.97 75.78,24.26 75.93,24.41 C17.- 76.08,24.56 76.08,26.7 C18.- | C18.- 75.93,26.85 75.93,29.29 C16.2 75.93,29.44 75.93,30.81 | 83.7,29.59 83.7,31.12 81.72,33.1 78.22,33.1 75.93,30.81
  Bottom 0.152: C22.2 78.52,26.85 76.08,26.85 C18.- | J1.3 65.27,28.53 62.83,30.96 J1.5 | 75.93,30.81 68.01,30.81 65.42,33.4 J1.4 | J2.4 39.51,33.56 60.24,33.56 J1.2 | U$4.GND 23.81,16.94 24.27,16.94 24.73,16.49 24.73,15.72 23.51,14.51 17.87,14.51 17.56,14.81 17.56,19.08 18.48,19.99 R39.1 18.63,20.14 18.63,22.43 R40.1 | C37.2 20.76,22.58 18.63,22.58 R40.1
PWRKEY  (via drill 0.35)
  Top 0.152: 47.28,14.66 48.81,13.13 C4.2 | 47.28,14.66 45.76,16.18 45.45,16.18 Q4.3 | S1.1 53.84,33.25 57.03,30.05 57.03,29.59 R16.1 57.19,29.44 v58.41,28.22 | v93.61,22.28 93.61,24.72 91.94,26.39 91.94,32.18 IC1.3 | v75.93,21.06 75.93,22.89 70.45,28.37 68.31,28.37 66.79,26.85 v66.79,26.7 | 47.28,14.66 47.74,15.12 v47.74,15.27
  Bottom 0.152: v93.61,22.28 93.15,22.28 91.33,20.45 76.54,20.45 v75.93,21.06 | v66.79,26.7 59.93,26.7 v58.41,28.22 56.12,28.22 53.68,30.66 50.33,30.66 49.41,29.75 49.41,17.4 47.74,15.72 v47.74,15.27
RST/EN  (via drill 0.35)
  Top 0.152: v9.64,10.09 9.64,9.78 10.25,9.17 10.25,8.71 U$3.EN | 10.4,5.51 10.4,3.53 10.71,3.23 C28.2 | 10.4,5.51 11.31,5.51 | 11.31,5.51 13.14,5.51 R24.2 | 10.4,5.51 R25.1 | 11.31,5.51 v11.31,6.89
  Bottom 0.152: 9.79,10.09 10.4,10.7 Q3.6 | 9.79,10.09 9.79,8.41 v11.31,6.89 | 9.79,10.09 v9.64,10.09
RST_EN
  Bottom 0.152: J3.C2 85.08,23.04 83.7,24.41 83.7,26.39 D2.3 83.55,26.54 82.94,27.16 82.94,30.2 81.11,32.03 R10.1
RTS
  Bottom 0.152: Q3.1 10.55,12.83 10.55,11.91 11.01,11.46 11.01,10.85 Q3.5
SIM_CLK  (via drill 0.35)
  Top 0.152: v91.94,25.48 89.04,25.48 v88.73,25.78 | v80.66,25.33 80.66,30.2 80.5,30.36 79.13,30.36 78.98,30.2 78.98,28.37 78.68,28.07 77.46,28.07 75.93,29.59 75.93,32.18 IC1.19
  Bottom 0.152: v91.94,25.48 91.94,25.63 93,26.7 R11.2 | v88.73,25.78 89.19,25.78 90.11,26.7 C19.1 90.26,26.85 91.48,28.07 95.9,28.07 96.2,27.76 96.2,25.78 91.17,20.75 83.25,20.75 81.72,22.28 81.72,23.8 80.66,24.87 v80.66,25.33
SIM_IO  (via drill 0.35)
  Top 0.152: v72.88,33.25 73.19,33.56 77.15,33.56 77.76,32.95 77.76,32.34 IC1.17
  Bottom 0.152: C20.1 90.11,29.44 89.8,29.75 89.8,32.03 R9.1 89.65,32.18 88.43,33.4 78.07,33.4 77.91,33.25 v72.88,33.25
SIM_RST  (via drill 0.35)
  Top 0.152: v77.3,30.66 76.85,31.12 76.85,32.18 IC1.18
  Bottom 0.152: 79.13,31.73 79.13,32.03 R10.2 79.13,31.73 | 79.13,31.73 81.42,29.44 C21.1 | v77.3,30.66 78.07,30.66 79.13,31.73
STATUS  (via drill 0.35)
  Top 0.152: v38.75,26.09 37.83,25.17 37.83,24.41 R19.1 | v41.49,27.61 v40.27,26.39 | v48.5,30.81 48.96,30.81 50.33,29.44 v55.82,29.44 | v60.08,29.9 64.05,29.9 64.96,30.81 68.47,30.81 76.54,22.73 76.54,9.48 79.74,6.28 80.5,6.28 80.81,5.97 80.81,4.29 81.57,3.53 82.18,3.53 82.79,2.92 82.79,2.31 IC1.49
  Bottom 0.152: v38.75,26.09 39.97,26.09 v40.27,26.39 | v41.49,27.61 45.15,27.61 48.35,30.81 v48.5,30.81 | v55.82,29.44 59.63,29.44 v60.08,29.9
U0RXD  (via drill 0.35)
  Top 0.152: v12.84,23.19 12.84,26.54 U$3.RXD0
  Bottom 0.152: v12.84,23.19 12.23,22.58 11.47,22.58 R4.2
U0TXD  (via drill 0.35)
  Top 0.152: v9.79,23.19 9.79,24.41 11.62,26.24 U$3.TXD0
  Bottom 0.152: v9.79,23.19 9.18,22.58 8.57,22.58 R5.2
UART_DTR  (via drill 0.35)
  Top 0.152: v52.92,18.47 51.7,18.47 IC4.6 | v91.78,5.51 91.78,9.17 95.29,12.68 95.29,17.1 95.44,17.25 97.27,17.25 98.03,18.01 98.03,18.16 98.49,18.62 99.25,18.62 IC1.72
  Bottom 0.152: v52.92,18.47 53.38,18.47 66.33,5.51 v91.78,5.51
UART_RI  (via drill 0.35)
  Top 0.152: v52.77,19.54 51.7,19.54 IC4.8 | v92.39,6.43 92.39,8.71 95.59,11.91 97.27,11.91 97.73,12.37 97.73,14.81 98.64,15.72 99.25,15.72 IC1.69
  Bottom 0.152: v52.77,19.54 66.18,6.12 92.09,6.12 v92.39,6.43
UART_TXD  (via drill 0.35)
  Top 0.152: v50.79,15.12 50.79,16.03 IC4.1 | v76.69,4.9 76.69,6.89 v77.46,7.65 | v97.73,16.79 98.64,17.71 99.25,17.71 IC1.71
  Bottom 0.152: v50.79,15.12 56.27,15.12 66.48,4.9 v76.69,4.9 | v77.46,7.65 88.58,7.65 v97.73,16.79
VBUS  (via drill 0.35)
  Top 0.152: IC5.A4 48.81,9.48 48.81,10.09 48.96,10.24 51.09,10.24 51.24,10.09 51.24,9.48 IC5.A9 51.24,9.32 51.24,8.26 IC5.B4 | v25.49,14.2 27.47,14.2 v27.62,14.35 | v33.41,8.26 33.41,8.87 v34.02,9.48 | v30.67,12.83 v30.67,14.2
  Bottom 0.152: v25.49,14.2 17.72,14.2 16.95,14.96 14.67,14.96 D1.2 | v27.62,14.35 27.62,13.9 29.15,12.37 30.67,12.37 | 30.67,12.37 32.04,12.37 32.8,11.61 R29.2 32.96,11.46 32.96,11.15 34.02,10.09 v34.02,9.48 35.39,8.11 41.64,8.11 42.41,8.87 50.79,8.87 51.24,8.41 51.24,8.26 IC5.B4 | v33.41,8.26 32.35,9.32 30.67,9.32 C29.1 | 30.67,12.37 v30.67,12.83 | 30.67,15.57 32.5,15.57 U$1.VIN | 30.67,15.57 30.67,17.71 R35.1 | 30.67,15.57 R34.1 v30.67,14.2
VCC3V3  (via drill 0.35)
  Top 0.152: v46.37,16.49 48.2,16.49 IC4.19 | R21.2 21.07,28.83 v21.07,30.66 21.07,32.79 20.76,33.1 C27.2 | 12.53,32.34 12.53,33.1 C24.2 12.53,32.34 | 12.53,32.34 12.53,31.12 R22.2 | C26.2 16.95,30.96 16.95,28.83 R23.2 16.8,28.83 15.58,28.83 | 15.58,28.83 14.52,28.83 R20.2 | v13.91,32.34 12.53,32.34 | 15.58,28.83 v15.58,29.9 | v16.34,4.45 15.28,5.51 R24.1 15.12,5.67 13.3,7.5 9.79,7.5 9.18,8.11 9.18,8.56 U$3.VDD33 9.03,8.71 9.03,9.17 6.74,11.46 v6.74,26.39 | v35.55,22.43 34.48,23.5 34.48,25.78 v35.24,26.54
  Bottom 0.152: v46.37,16.49 44.39,16.49 40.58,20.3 35.55,20.3 | 35.55,20.3 34.63,19.38 PS1.4 | 13.91,31.57 v13.91,32.34 | 13.91,31.57 v15.58,29.9 16.34,30.66 v21.07,30.66 21.53,31.12 31.74,31.12 32.8,30.05 32.8,28.53 34.02,27.31 34.48,27.31 v35.24,26.54 | v16.34,4.45 17.72,5.82 28.54,5.82 29.91,7.19 30.52,7.19 C33.1 | 13.91,31.57 12.38,31.57 7.2,26.39 v6.74,26.39 | v35.55,22.43 35.55,20.3
VCC_4V2  (via drill 0.35)
  Top 0.152: v30.06,28.53 30.52,28.53 31.43,27.61 31.43,25.63 29.15,23.34 v27.32,23.34 | v41.19,8.71 41.64,8.71 47.13,3.23 v50.63,3.23 | v45.3,15.12 46.06,15.12 47.43,13.74 v47.43,13.59
  Bottom 0.152: C32.1 26.25,29.44 27.01,28.68 28.54,28.68 C31.1 28.69,28.53 v30.06,28.53 | D5.2 26.25,24.41 v27.32,23.34 29.76,20.91 31.89,20.91 32.65,20.14 33.11,20.14 34.02,19.23 34.02,18.62 34.48,18.16 36.92,18.16 37.07,18.01 R32.2 37.22,18.01 37.98,18.77 39.36,18.77 C30.1 39.51,18.77 41.64,18.77 v45.3,15.12 | v50.63,3.23 50.94,3.23 51.7,3.99 L2.2 | R31.2 34.78,13.74 34.78,13.29 33.87,12.37 33.87,10.7 35.85,8.71 v41.19,8.71 41.34,8.71 46.21,13.59 v47.43,13.59
VCC_UART
  Bottom 0.152: 7.96,17.86 7.96,17.4 IC3.5 | 7.96,17.86 6.44,17.86 6.29,18.01 C2.1 6.13,18.16 4.15,18.16 C3.1 | 7.96,17.86 IC3.6
VDD_1V8  (via drill 0.35)
  Top 0.152: IC4.2 51.55,16.49 v51.55,15.88 51.55,13.13 C23.2 | v51.4,20.75 51.24,20.6 50.79,20.6 IC4.10 | v65.87,32.03 67.7,33.86 78.83,33.86 79.74,32.95 79.74,32.34 IC1.15 | v67.25,30.2 64.81,30.2 v60.54,25.94
  Bottom 0.152: v51.55,15.88 51.4,16.03 v51.4,20.75 56.58,25.94 v60.54,25.94 | v65.87,32.03 65.87,31.57 v67.25,30.2
VDD_3V  (via drill 0.35)
  Top 0.152: v64.5,9.17 65.11,8.56 65.72,8.56 R8.1 | v66.03,26.09 66.03,27.16 v67.55,28.68 | v71.36,9.32 77.76,2.92 77.76,2.31 IC1.44
  Bottom 0.152: v64.5,9.17 64.5,24.56 v66.03,26.09 | v67.55,28.68 67.55,28.22 71.36,24.41 v71.36,9.32
VDD_4V2
  Bottom 0.152: D6.1 26.1,17.71 26.1,19.99 R38.2 | Q6.3 28.38,20.75 26.86,20.75 26.25,20.14 R38.2 | 22.59,23.65 19.85,23.65 19.24,24.26 18.63,24.26 R40.2 | 22.59,23.65 23.66,24.72 C38.1 | 22.59,23.65 23.66,22.58 C37.1 23.81,22.43 26.1,20.14 R38.2
VSIM  (via drill 0.35)
  Top 0.152: v80.05,27.76 77.3,27.76 74.87,30.2 74.87,32.18 IC1.20
  Bottom 0.152: D2.4 83.7,28.53 83.7,28.83 84.16,29.29 85.23,29.29 86.3,28.22 86.3,25.78 86.91,25.17 90.72,25.17 92.09,26.54 92.09,27.61 92.24,27.76 95.75,27.76 95.9,27.61 95.9,25.94 91.02,21.06 84.31,21.06 82.49,22.89 J3.C1 82.33,23.04 82.33,23.65 81.57,24.41 81.57,26.7 C22.1 81.42,26.85 80.5,27.76 v80.05,27.76
VVBAT  (via drill 0.35)
  Top 0.152: 20.92,5.51 22.44,5.51 C35.1 | 20.92,5.51 19.85,5.51 R28.2 | v23.96,3.69 23.51,3.23 22.59,3.23 C36.1 | v20.92,4.29 20.92,5.51 | v20.31,13.44 v20.31,15.12
  Bottom 0.152: 20.92,3.69 16.19,3.69 15.73,4.14 15.73,7.04 19.39,10.7 20.31,10.7 | 20.92,3.69 v23.96,3.69 | 20.31,10.7 20.61,10.7 20.76,10.54 | 20.92,3.69 v20.92,4.29 | Q5.3 27.01,12.37 27.01,11.3 25.03,9.32 25.03,7.95 24.88,7.8 23.51,7.8 20.92,10.39 L3.1 20.31,10.7 | v20.31,15.12 20,15.42 18.78,15.42 R37.2 | 20.31,10.7 v20.31,13.44

## Text on the board
tNames: BIKEBIKEAJA | TA